# Altium project PCB_Project4.PrjPCB
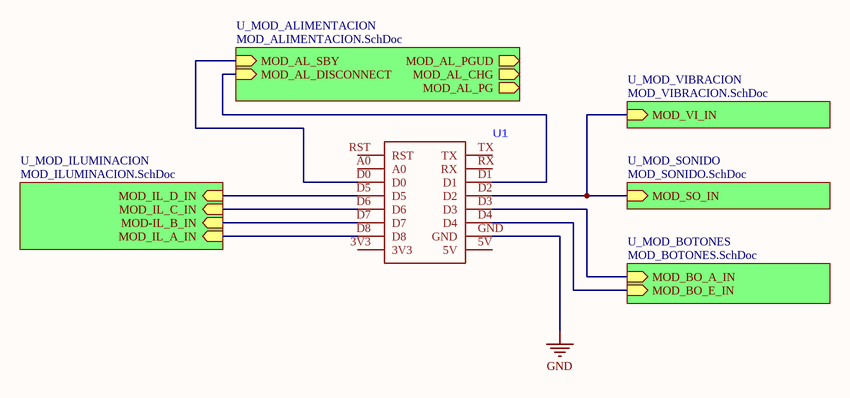
[diagram p0: PULSERA.SchDoc]
6 sheets, 53 parts. Net scope: hierarchical (ports join the sheet entries above them; power ports are global).
Board file: PCB1.PcbDoc
Sheets:
  PULSERA.SchDoc
    U_MOD_BOTONES = MOD_BOTONES.SchDoc
    U_MOD_ILUMINACION = MOD_ILUMINACION.SchDoc
    U_MOD_SONIDO = MOD_SONIDO.SchDoc
    U_MOD_VIBRACION = MOD_VIBRACION.SchDoc
    U_MOD_ALIMENTACION = MOD_ALIMENTACION.SchDoc

## Sheet PULSERA.SchDoc
size A4

### Parts
(Parts that share a designator on the sheet are numbered #1, #2 ... from top to bottom, then left to right.)
U1#1  (no value)  [WEMOS D1 MINI]

### Sub-sheets
U_MOD_ALIMENTACION = MOD_ALIMENTACION.SchDoc: MOD_AL_PGUD (out), MOD_AL_CHG (out), MOD_AL_PG (out), MOD_AL_SBY (in), MOD_AL_DISCONNECT (in)
U_MOD_BOTONES = MOD_BOTONES.SchDoc: MOD_BO_A_IN (in), MOD_BO_E_IN (in)
U_MOD_ILUMINACION = MOD_ILUMINACION.SchDoc: MOD_IL_A_IN (in), MOD-IL_B_IN (in), MOD_IL_C_IN (in), MOD_IL_D_IN (in)
U_MOD_SONIDO = MOD_SONIDO.SchDoc: MOD_SO_IN (in)
U_MOD_VIBRACION = MOD_VIBRACION.SchDoc: MOD_VI_IN (in)

### Nets
GND: U1#1.GND
NetR1_1: U1#1.D8 ; sheet U_MOD_ILUMINACION/MOD_IL_A_IN
NetR2_1: U1#1.D7 ; sheet U_MOD_ILUMINACION/MOD-IL_B_IN
NetR3_1: U1#1.D6 ; sheet U_MOD_ILUMINACION/MOD_IL_C_IN
NetR4_1: U1#1.D5 ; sheet U_MOD_ILUMINACION/MOD_IL_D_IN
NetR14_1: U1#1.D2 ; sheet U_MOD_SONIDO/MOD_SO_IN, sheet U_MOD_VIBRACION/MOD_VI_IN
NetR16_1: U1#1.D3 ; sheet U_MOD_BOTONES/MOD_BO_A_IN
NetR18_1: U1#1.D4 ; sheet U_MOD_BOTONES/MOD_BO_E_IN
NetU1#1_D0: U1#1.D0 ; sheet U_MOD_ALIMENTACION/MOD_AL_SBY
NetU1#1_D1: U1#1.D1 ; sheet U_MOD_ALIMENTACION/MOD_AL_DISCONNECT

Not connected (* = marked no-connect by the designer): U1#1 3V3 5V A0 RST RX TX

### Library data of the parts
U1#1 = WEMOS D1 MINI

## Sheet MOD_BOTONES.SchDoc
size A4
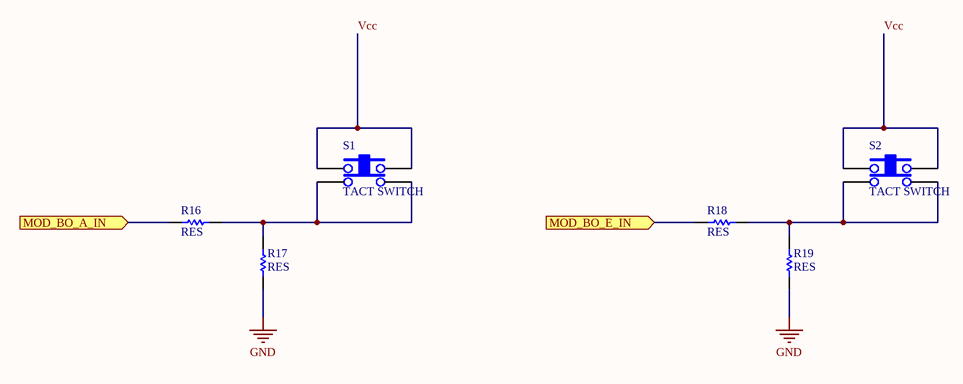
[diagram p1: MOD_BOTONES.SchDoc]

### Parts
R16  RES  [0805]
R17  RES  [0805]
R18  RES  [0805]
R19  RES  [0805]
S1  TACT SWITCH  [TACTSWITCH]
S2  TACT SWITCH  [TACTSWITCH]

### Ports
MOD_BO_A_IN (in), MOD_BO_E_IN (in)

### Nets
GND: R17.1 R19.1
Vcc: S1.1 S1.3 S2.1 S2.3
NetR16_1: R16.1 ; port MOD_BO_A_IN
NetR16_2: R16.2 R17.2 S1.2 S1.4
NetR18_1: R18.1 ; port MOD_BO_E_IN
NetR18_2: R18.2 R19.2 S2.2 S2.4

## Sheet MOD_ILUMINACION.SchDoc
size A4
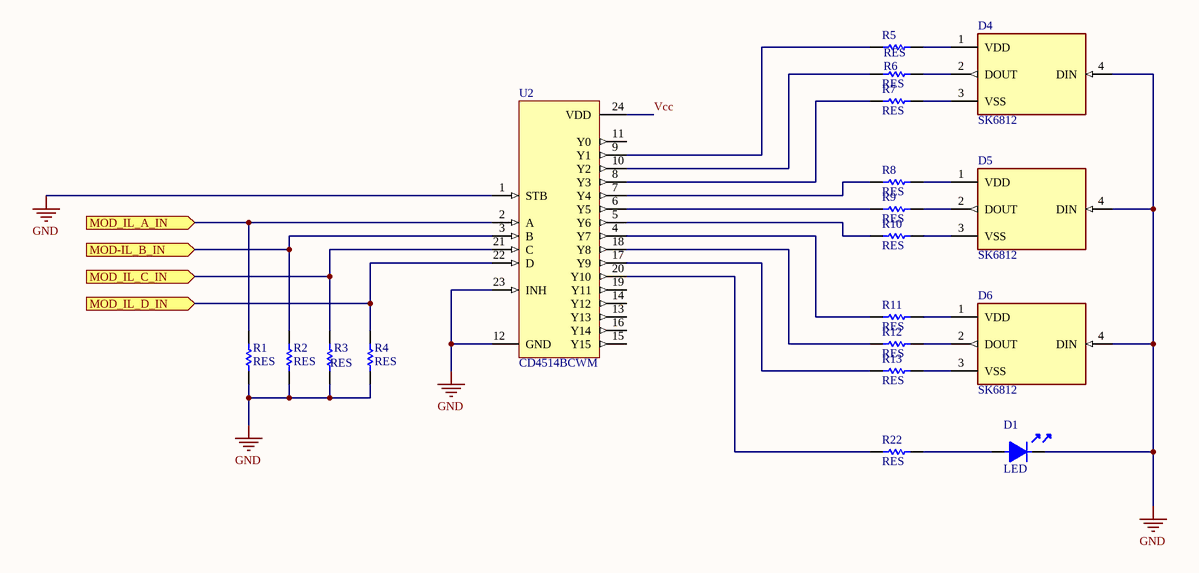
[diagram p2: MOD_ILUMINACION.SchDoc]

### Parts
(Parts that share a designator on the sheet are numbered #1, #2 ... from top to bottom, then left to right.)
D1  LED  [0805]
D4  SK6812  [LED_SK6812]
D5  SK6812  [LED_SK6812]
D6  SK6812  [LED_SK6812]
R1  RES  [0805]
R2  RES  [0805]
R3  RES  [0805]
R4  RES  [0805]
R5  RES  [0805]
R6  RES  [0805]
R7  RES  [0805]
R8  RES  [0805]
R9  RES  [0805]
R10  RES  [0805]
R11  RES  [0805]
R12  RES  [0805]
R13  RES  [0805]
R22  RES  [0805]
U2#1  CD4514BCWM  [M24B_M]

### Ports
MOD-IL_B_IN (in), MOD_IL_A_IN (in), MOD_IL_C_IN (in), MOD_IL_D_IN (in)

### Nets
GND: D1.2 D4.4(DIN) D5.4(DIN) D6.4(DIN) R1.2 R2.2 R3.2 R4.2 U2#1.1(STB) U2#1.12(GND) U2#1.23(INH)
Vcc: U2#1.24(VDD)
NetD1_1: D1.1 R22.2
NetD4_1: D4.1(VDD) R5.2
NetD4_2: D4.2(DOUT) R6.2
NetD4_3: D4.3(VSS) R7.2
NetD5_1: D5.1(VDD) R8.2
NetD5_2: D5.2(DOUT) R9.2
NetD5_3: D5.3(VSS) R10.2
NetD6_1: D6.1(VDD) R11.2
NetD6_2: D6.2(DOUT) R12.2
NetD6_3: D6.3(VSS) R13.2
NetR1_1: R1.1 U2#1.2(A) ; port MOD_IL_A_IN
NetR2_1: R2.1 U2#1.3(B) ; port MOD-IL_B_IN
NetR3_1: R3.1 U2#1.21(C) ; port MOD_IL_C_IN
NetR4_1: R4.1 U2#1.22(D) ; port MOD_IL_D_IN
NetR5_1: R5.1 U2#1.9(Y1)
NetR6_1: R6.1 U2#1.10(Y2)
NetR7_1: R7.1 U2#1.8(Y3)
NetR8_1: R8.1 U2#1.7(Y4)
NetR9_1: R9.1 U2#1.6(Y5)
NetR10_1: R10.1 U2#1.5(Y6)
NetR11_1: R11.1 U2#1.4(Y7)
NetR12_1: R12.1 U2#1.18(Y8)
NetR13_1: R13.1 U2#1.17(Y9)
NetR22_1: R22.1 U2#1.20(Y10)

Not connected (* = marked no-connect by the designer): U2#1 11(Y0) 13(Y13) 14(Y12) 15(Y15) 16(Y14) 19(Y11)

### Library data of the parts
D4-D6 = SK6812: SMD 5050 Full color RGB LED data transmission frequency up to 800Kbps, with 30 fps refresh rate, 5.00x5.00 mm; MF: Shenzhen LED Color Optoelectronic Inc.; Package: SMD-4 Shenzhen LED Color Optoelectronic Inc.; Value: *; Check_prices: https://www.snapeda.com/parts/SK6812/Shenzhen%20LED%20Color%20Optoelectronic%20Inc./view-part/554016/?ref=eda; Price: None; Availability: Unavailable; MP: SK6812; SnapEDA_Link: https://www.snapeda.com/parts/SK6812/Shenzhen%20LED%20Color%20Optoelectronic%20Inc./view-part/554016/?ref=snap
U2#1 = CD4514BCWM: 4 Bit Latched/4-to-16-Line Decoder; Published: 17-Jul-2002; LatestRevisionDate: 13-Apr-2006; LatestRevisionNote: IPC-7351 Footprint Added.; DatasheetVersion: Jan-1999; PackageVersion: 2000; PackageReference: M24B; Publisher: Altium Limited; PackageDescription: 24-Pin Small Outline Integrated Circuit 1.27 mm Pitch; ComponentLink1Description: Manufacturer Link; ComponentLink1URL: http://www.fairchildsemi.com/; ComponentLink2Description: Datasheet; ComponentLink2URL: http://www.fairchildsemi.com/ds/CD%2FCD4514BC.pdf

## Sheet MOD_SONIDO.SchDoc
size A4
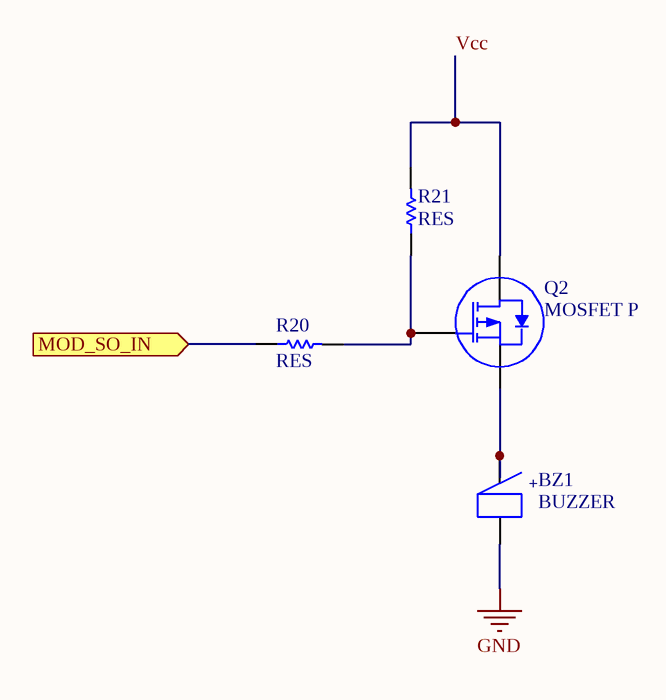
[diagram p3: MOD_SONIDO.SchDoc]

### Parts
BZ1  BUZZER  [BUZZER 12MM]
Q2  MOSFET P  [SOT23]
R20  RES  [0805]
R21  RES  [0805]

### Ports
MOD_SO_IN (in)

### Nets
GND: BZ1.2
Vcc: Q2.2(D) R21.2
NetBZ1_1: BZ1.1 Q2.3(S)
NetQ2_1: Q2.1(G) R20.2 R21.1
NetR14_1: R20.1 ; port MOD_SO_IN

### Notes on the sheet
- (in symbol BUZZER) +

## Sheet MOD_VIBRACION.SchDoc
size A4
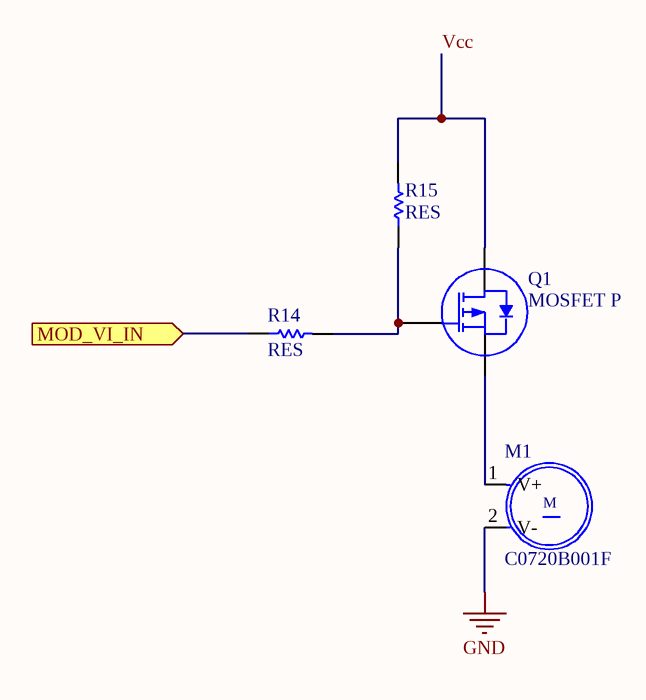
[diagram p4: MOD_VIBRACION.SchDoc]

### Parts
M1  C0720B001F  [XDCR_C0720B001F]
Q1  MOSFET P  [SOT23]
R14  RES  [0805]
R15  RES  [0805]

### Ports
MOD_VI_IN (in)

### Nets
GND: M1.2(V-)
Vcc: Q1.2(D) R15.2
NetM1_1: M1.1(V+) Q1.3(S)
NetQ1_1: Q1.1(G) R14.2 R15.1
NetR14_1: R14.1 ; port MOD_VI_IN

### Notes on the sheet
- (in symbol C0720B001F) M

### Library data of the parts
M1 = C0720B001F: DC Motor Vibration, ERM 10000 RPM 3VDC; MF: Jinlong Machinery; Availability: Unavailable; SnapEDA_Link: https://www.snapeda.com/parts/C0720B001F/Jinlong%20Machinery%20%26%20Electronics%2C%20Inc./view-part/645169/?ref=snap; MP: C0720B001F; Value: *; Price: None; Package: Jinlong Machinery

## Sheet MOD_ALIMENTACION.SchDoc
size A
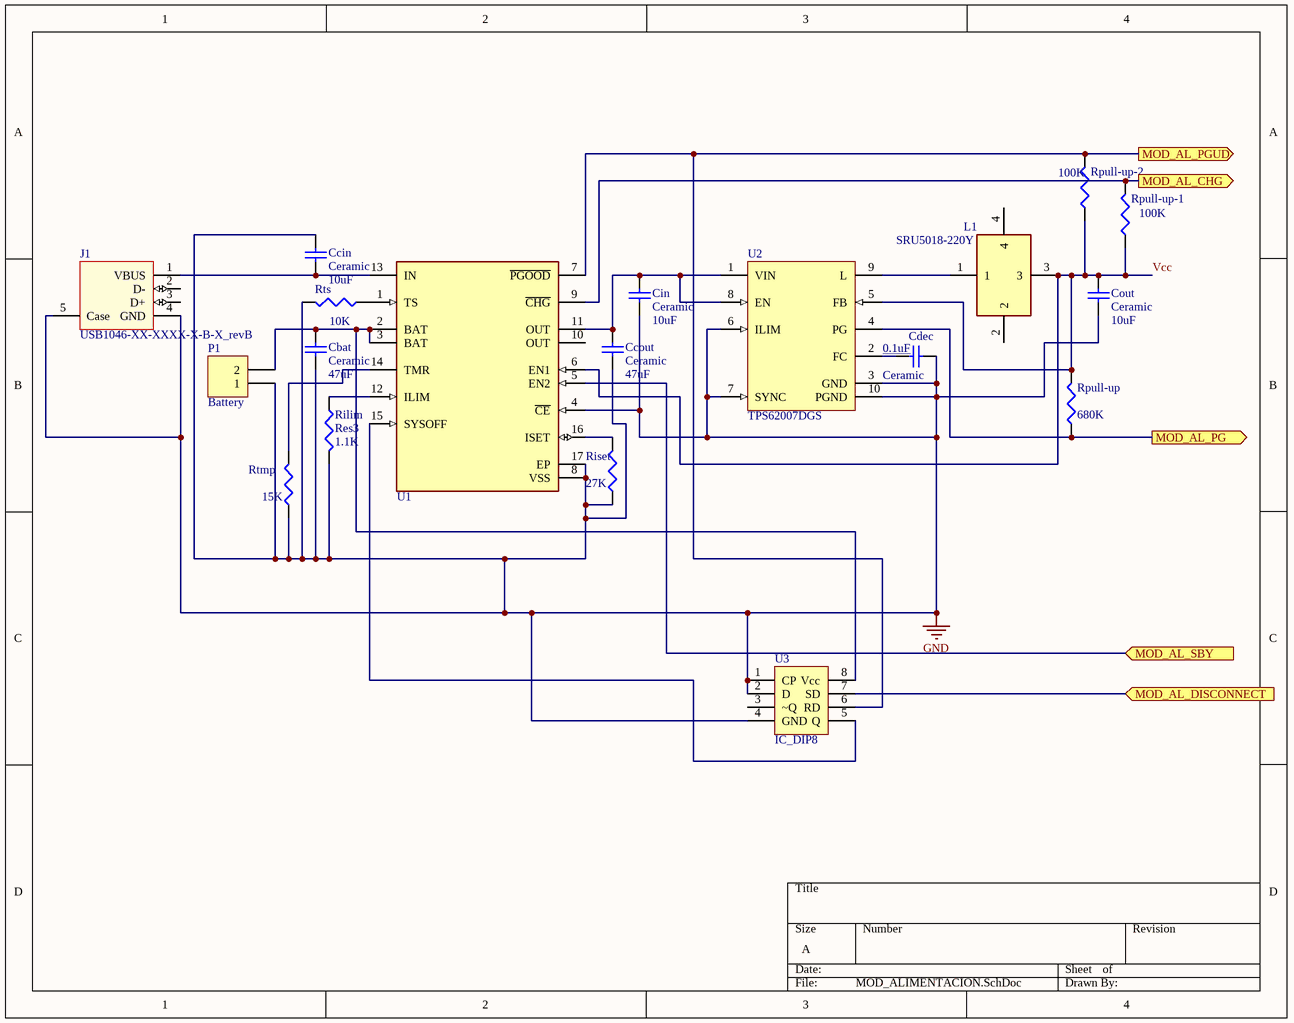
[diagram p5: MOD_ALIMENTACION.SchDoc]

### Parts
(Parts that share a designator on the sheet are numbered #1, #2 ... from top to bottom, then left to right.)
Cbat  Ceramic  value 47uF  [RAD-0.3]
Ccin  Ceramic  value 10uF  [RAD-0.3]
Ccout  Ceramic  value 47uF  [RAD-0.3]
Cdec  Ceramic  value 0.1uF  [RAD-0.3]
Cin  Ceramic  value 10uF  [RAD-0.3]
Cout  Ceramic  value 10uF  [RAD-0.3]
J1  USB1046-XX-XXXX-X-B-X_revB  [USB1046-XX-XXXX-X-B-X_revB]
L1  SRU5018-220Y  [SRU5018680Y]
P1  Battery  [HDR1X2]
Rilim  Res3  value 1.1K  [J1-0603]
Riset  value 27K  [J1-0603]
Rpull-up  value 680K  [J1-0603]
Rpull-up-1  value 100K  [J1-0603]
Rpull-up-2  value 100K  [J1-0603]
Rtmp  value 15K  [J1-0603]
Rts  value 10K  [J1-0603]
U1#2  BQ24075RGTT  (value not drawn)
U2#2  TPS62007DGS  [DGS10_L]
U3  IC_DIP8  [DIP8]

### Ports
MOD_AL_CHG (out), MOD_AL_DISCONNECT (in), MOD_AL_PG (out), MOD_AL_PGUD (out), MOD_AL_SBY (in)

### Nets
GND: Cbat.2 Ccin.2 Ccout.1 Cdec.2 Cin.1 Cout.1 J1.4(GND) J1.5(Case) P1.1 Rilim.2 Riset.1 Rtmp.1 Rts.2 U1#2.4(~{CE}) U1#2.8(VSS) U1#2.17(EP) U2#2.3(GND) U2#2.6(ILIM) U2#2.7(SYNC) U2#2.10(PGND) U3.1(CP) U3.2(D) U3.4(GND)
Vcc: Cout.2 L1.3 Rpull-up.2 Rpull-up-1.1 Rpull-up-2.1 U1#2.6(EN1) U2#2.5(FB)
NetCbat_1: Cbat.1 P1.2 U1#2.2(BAT) U1#2.3(BAT) U3.8(Vcc)
NetCcin_1: Ccin.1 J1.1(VBUS) U1#2.13(IN)
NetCcout_2: Ccout.2 Cin.2 U1#2.11(OUT) U2#2.1(VIN) U2#2.8(EN)
NetCdec_1: Cdec.1 U2#2.2(FC)
NetL1_1: L1.1 U2#2.9(L)
NetRilim_1: Rilim.1 U1#2.12(ILIM)
NetRiset_2: Riset.2 U1#2.16(ISET)
NetRpull-up-1_2: Rpull-up-1.2 U1#2.9(~{CHG}) ; port MOD_AL_CHG
NetRpull-up-2_2: Rpull-up-2.2 U1#2.7(~{PGOOD}) U3.6(RD) ; port MOD_AL_PGUD
NetRpull-up_1: Rpull-up.1 U2#2.4(PG) ; port MOD_AL_PG
NetRtmp_2: Rtmp.2 U1#2.14(TMR)
NetRts_1: Rts.1 U1#2.1(TS)
NetU1#1_D0: U1#2.5(EN2) ; port MOD_AL_SBY
NetU1#1_D1: U3.7(SD) ; port MOD_AL_DISCONNECT
NetU1#2_15: U1#2.15(SYSOFF) U3.5(Q)

Not connected (* = marked no-connect by the designer): J1 2(D-) 3(D+); L1 2 4; U1#2 10(OUT); U3 3(~Q)

### Library data of the parts
Cbat Ccin Ccout Cdec Cin Cout = Cap: Capacitor; Published: 8-Jun-2000; LatestRevisionDate: 17-Jul-2002; LatestRevisionNote: Re-released for DXP Platform.; PackageReference: RAD-0.3; Publisher: Altium Limited; PackageDescription: Radial Cap, Thru-Hole; 2 Leads; 0.3 in Pin Spacing
J1 = USB1046-XX-XXXX-X-B-X_revB: USB Receptecal, Type A, 4 Pin, Top Mount, SMT, Horizontal, with Kinked Shell Stakes
L1 = SRU5018-220Y: Inductor; Manufacturer_Name: Bourns; Datasheet Link: https://www.bourns.com/docs/Product-Datasheets/SRU5018.pdf; Height: 2mm; Manufacturer_Part_Number: SRU5018-220Y; Mouser Part Number: 652-SRU5018-220Y; Mouser Price/Stock: https://www.mouser.co.uk/ProductDetail/Bourns/SRU5018-220Y?qs=q9ZR8LvBB%2Fu2CA7Fi%252BOvOg%3D%3D; Arrow Part Number: SRU5018-220Y; Arrow Price/Stock: https://www.arrow.com/en/products/sru5018-220y/bourns
P1 = Header 2: Header, 2-Pin; LatestRevisionDate: 17-Jul-2002; LatestRevisionNote: Re-released for DXP Platform.; Publisher: Altium Limited
Rilim Riset Rpull-up Rpull-up-1 Rpull-up-2 Rtmp Rts = Res3: Resistor; Published: 8-Jun-2000; LatestRevisionDate: 29-May-2009; LatestRevisionNote: IPC-7351 Footprint Added.; PackageReference: J1-0603; Publisher: Altium Limited; PackageDescription: Chip Resistor
U2#2 = TPS62007DGS: Buck Step-Down Regulator with 2 V to 5.5 V Input and 3.3 V Output, -40 to 85 degC, 10-Pin MSOP (DGS), Green (RoHS & no Sb/Br); Manufacturer: Texas Instruments; Iq(Typ)(mA): 0.05; Vin(Min)(V): 2; Vout(Max)(V): 3.3; Duty Cycle(Max)(%): 100; Vin(Max)(V): 5.5; Rating: Catalog; Synchronous Rectification: TRUE; Regulated Outputs(#): 1; Switch Current Limit(Typ)(A): 1.6; Iout(Max)(A): 0.6; Preset Vout(V): 3.3; Eco-Plan: Green (RoHS & no Sb/Br); PartNumber: TPS62007DGS; SubFamily: Step-Down Regulator; ComponentLink1Description: Datasheet; ComponentLink2Description: Package Specification; Vout(Min)(V): 3.3; DatasheetVersion: SLVS294E; ComponentLink1URL: http://www.ti.com/general/docs/lit/getliterature.tsp?genericPartNumber=TPS62007&fileType=pdf; Code_JEDEC: MO-187-BA; ComponentLink2URL: http://www.ti.com/litv/pdf/mpds373; PackageReference: DGS10; PackageVersion: revC, Feb-2004; Mounting Technology: Surface Mount; Topology: Buck; PackageDescription: 10-Pin Thin Shrink Small Outline Package 0.5 mm Pitch

## Nets that join several sheets
GND: PULSERA (U1#1.GND), MOD_BOTONES (R17.1 R19.1), MOD_ILUMINACION (11 pins), MOD_SONIDO (BZ1.2), MOD_VIBRACION (M1.2), MOD_ALIMENTACION (23 pins)
NetR1_1: PULSERA (U1#1.D8), MOD_ILUMINACION (R1.1 U2#1.2)
NetR2_1: PULSERA (U1#1.D7), MOD_ILUMINACION (R2.1 U2#1.3)
NetR3_1: PULSERA (U1#1.D6), MOD_ILUMINACION (R3.1 U2#1.21)
NetR4_1: PULSERA (U1#1.D5), MOD_ILUMINACION (R4.1 U2#1.22)
NetR14_1: PULSERA (U1#1.D2), MOD_SONIDO (R20.1), MOD_VIBRACION (R14.1)
NetR16_1: PULSERA (U1#1.D3), MOD_BOTONES (R16.1)
NetR18_1: PULSERA (U1#1.D4), MOD_BOTONES (R18.1)
NetU1#1_D0: PULSERA (U1#1.D0), MOD_ALIMENTACION (U1#2.5)
NetU1#1_D1: PULSERA (U1#1.D1), MOD_ALIMENTACION (U3.7)